# EAGLE design spindle_light (EAGLE 9.5.1)
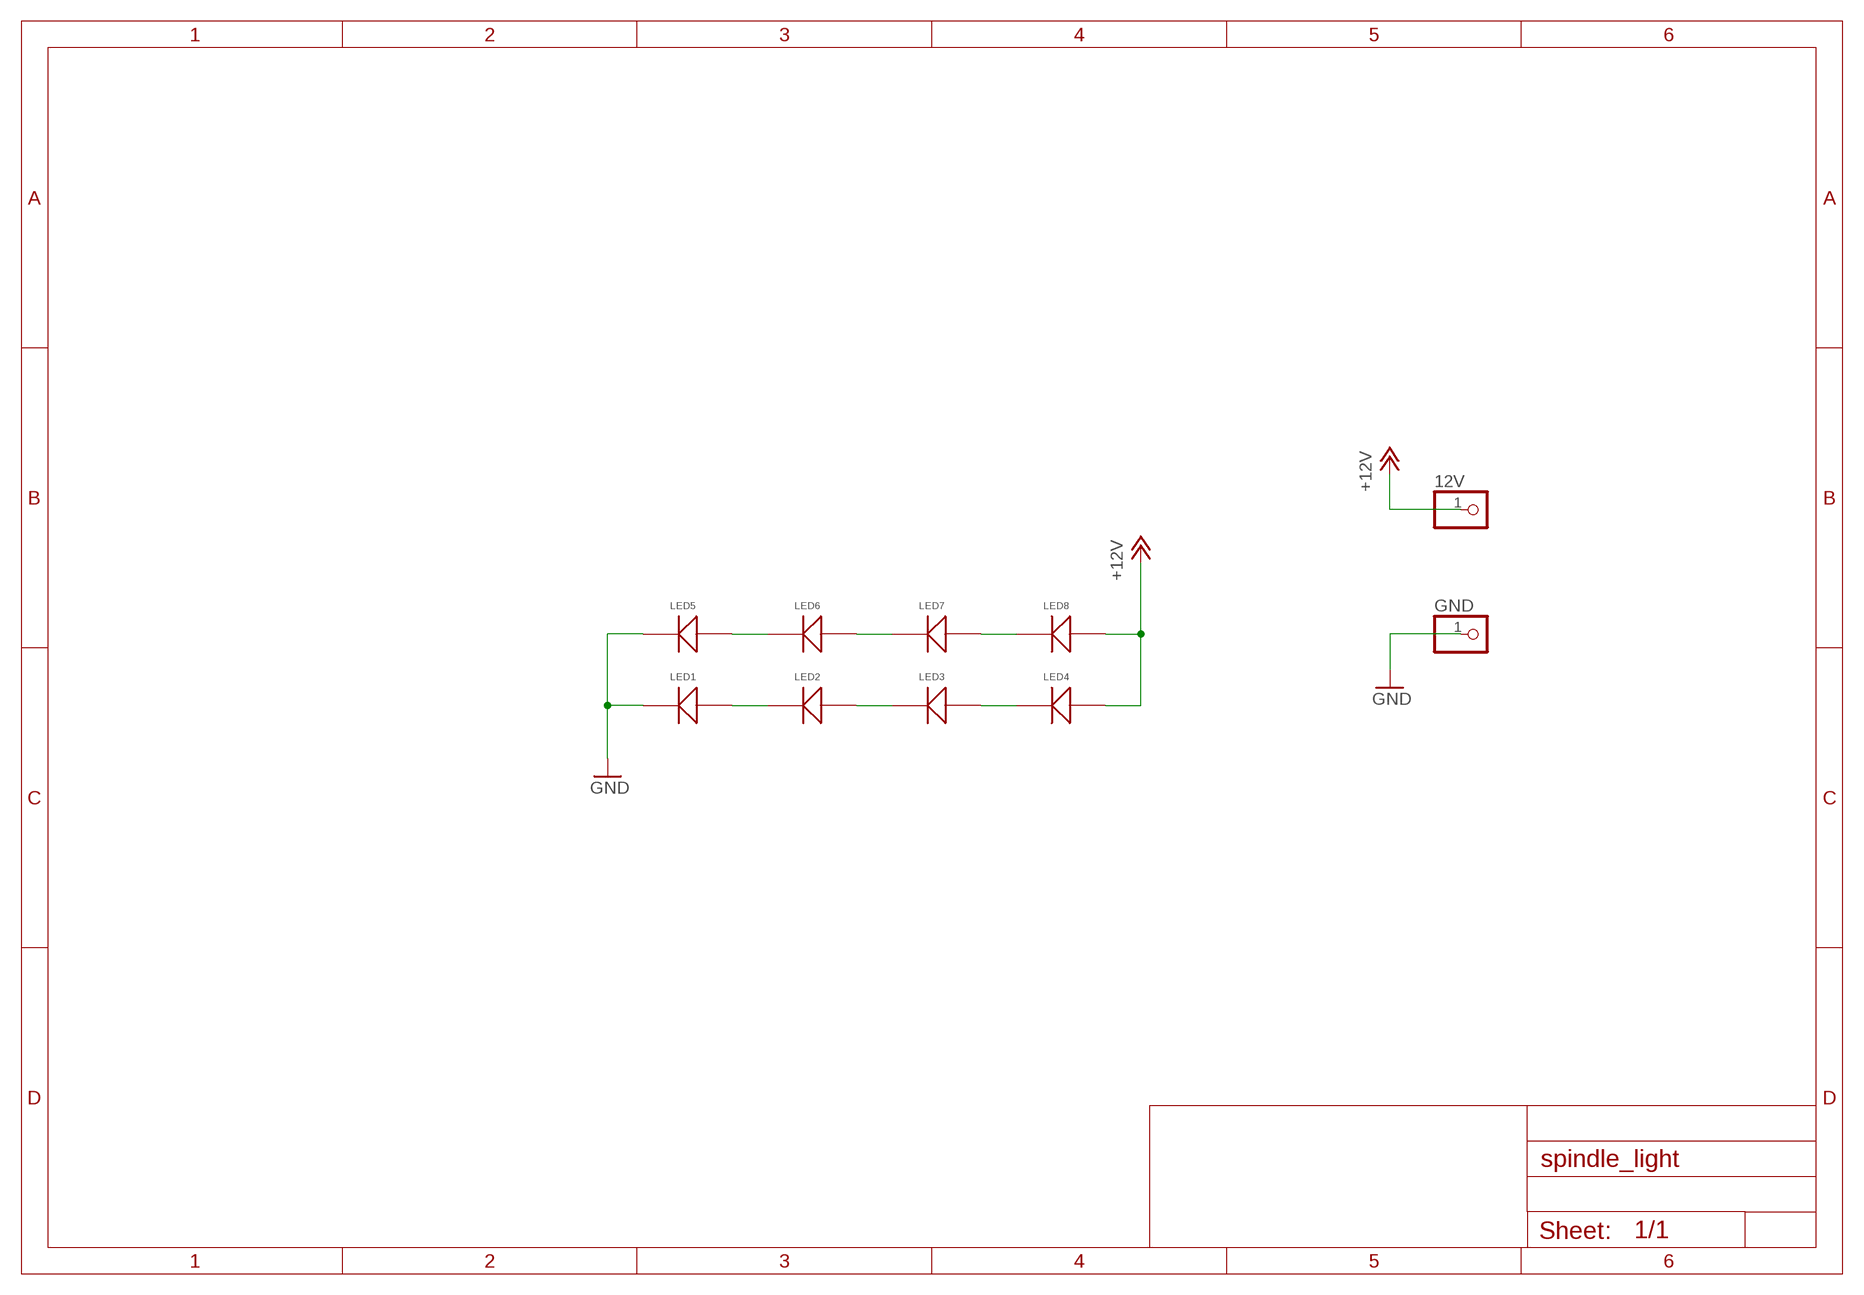
[diagram p0: schematic, sheet 1]

## Parts
12V  PINHD-1X1  [1X01]
GND  PINHD-1X1  [1X01]
LED1  RF-45HA50DS-EE-Y  [5050LED]
LED2  RF-45HA50DS-EE-Y  [5050LED]
LED3  RF-45HA50DS-EE-Y  [5050LED]
LED4  RF-45HA50DS-EE-Y  [5050LED]
LED5  RF-45HA50DS-EE-Y  [5050LED]
LED6  RF-45HA50DS-EE-Y  [5050LED]
LED7  RF-45HA50DS-EE-Y  [5050LED]
LED8  RF-45HA50DS-EE-Y  [5050LED]

## Nets
+12V: 12V.1 LED4.P$4 LED4.P$5 LED4.P$6 LED8.P$4 LED8.P$5 LED8.P$6
GND: GND.1 LED1.P$1 LED1.P$2 LED1.P$3 LED5.P$1 LED5.P$2 LED5.P$3
N$2: LED5.P$4 LED5.P$5 LED5.P$6 LED6.P$1 LED6.P$2 LED6.P$3
N$3: LED1.P$4 LED1.P$5 LED1.P$6 LED2.P$1 LED2.P$2 LED2.P$3
N$4: LED2.P$4 LED2.P$5 LED2.P$6 LED3.P$1 LED3.P$2 LED3.P$3
N$5: LED6.P$4 LED6.P$5 LED6.P$6 LED7.P$1 LED7.P$2 LED7.P$3
N$8: LED7.P$4 LED7.P$5 LED7.P$6 LED8.P$1 LED8.P$2 LED8.P$3
N$9: LED3.P$4 LED3.P$5 LED3.P$6 LED4.P$1 LED4.P$2 LED4.P$3

## Library data of the parts
12V GND = pinhead:PINHD-1X1: PIN HEADER
LED1-LED8 = NikodemBartnik:RF-45HA50DS-EE-Y: LED; SMD; 5050,PLCC6; biały neutralny; 5300÷10000mcd; 4450-5000K

## Board
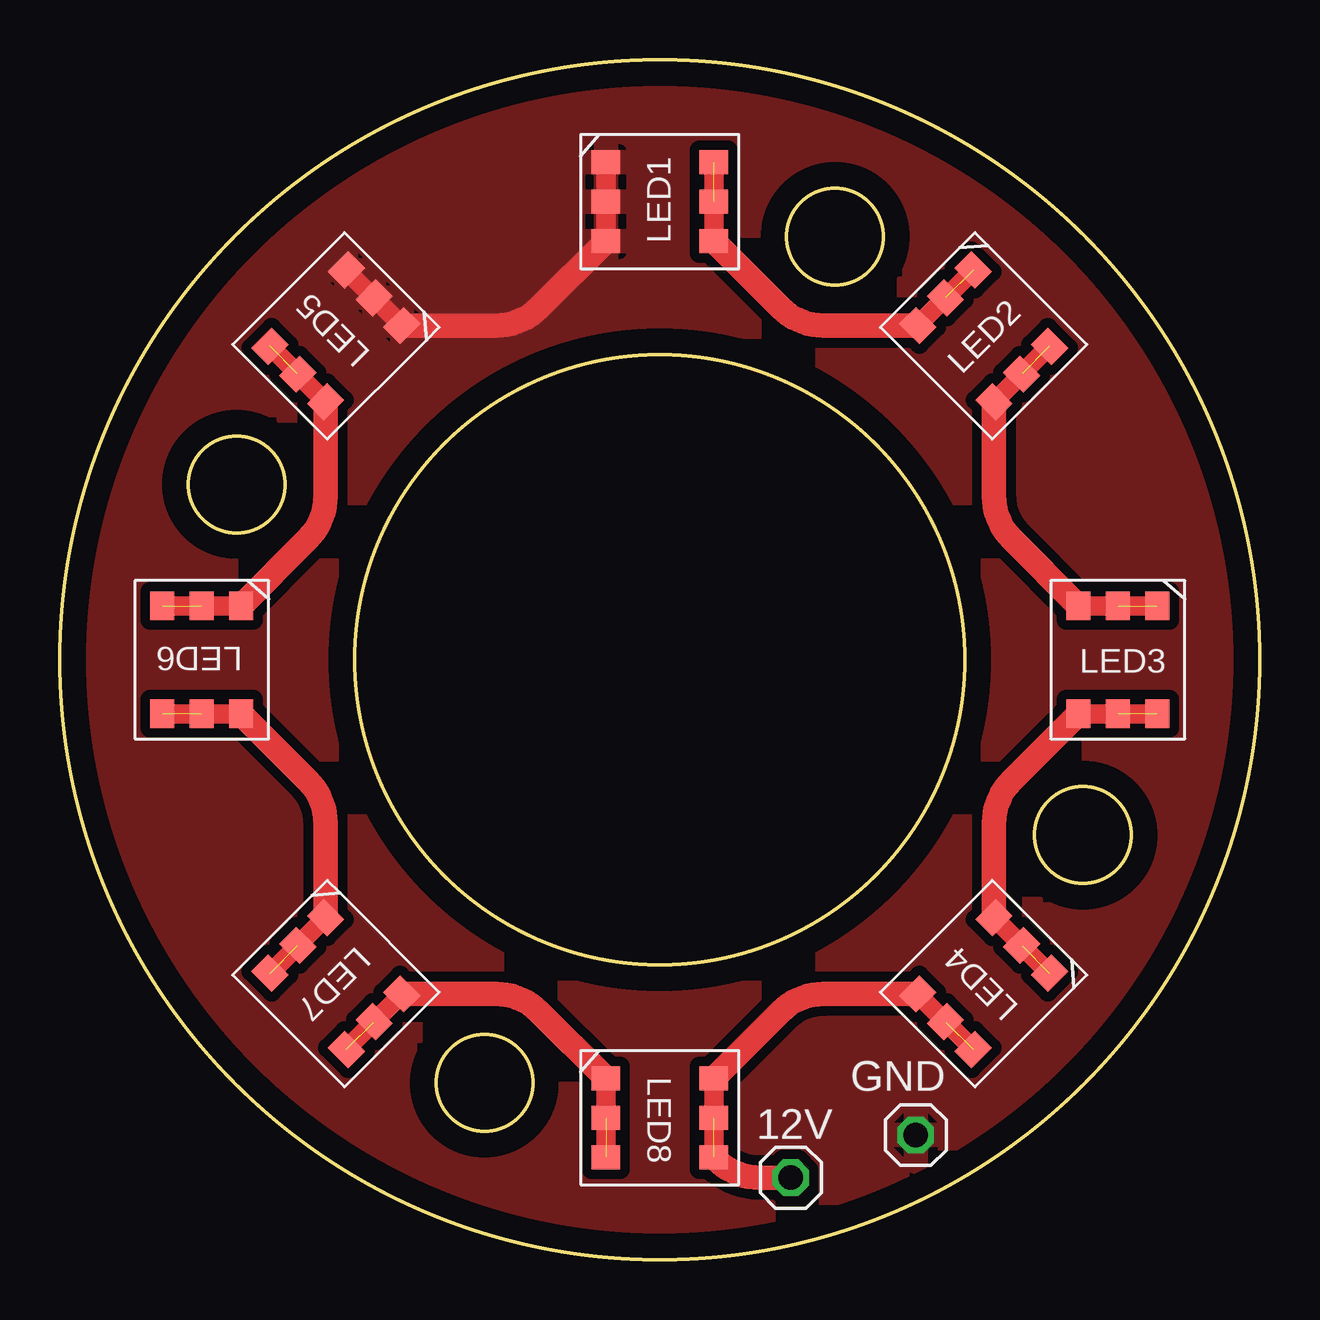
[diagram p1: board, top side]

Size 50 x 50 mm. Coordinates in mm from the lower left corner, seen from the top.
Outline: circle at 25,25 radius 25
Outline: circle at 25,25 radius 12.7
Outline: circle at 32.3,42.64 radius 2
Outline: circle at 42.64,17.7 radius 2
Outline: circle at 17.7,7.36 radius 2
Outline: circle at 7.36,32.3 radius 2
Copper layers (1*16): Top 0.035mm / dielectric 1.5mm / Bottom 0.035mm
Design rules "default": minimum track width 6mil, minimum drill 0.35mm, track to track 6mil, track to pad 6mil, pad to pad 6mil, via to via 6mil, smd to smd 6mil, copper to edge 40mil, drill to drill 6mil, minimum pad ring 10mil, minimum via ring 8mil, stop-mask expansion 4mil, vias tented up to drill 0mil, thermal gap 10mil

### Footprints (pad centres in the part's own frame; a part is rotated, then mirrored left to right if it is on the bottom)
1X01 = drill 1.016 octagon: 1 0,0
5050LED = smd 1.2 x 1: P$1 -2.25,1.64; P$2 -2.25,0; P$3 -2.25,-1.64; P$4 2.25,1.64; P$5 2.25,0; P$6 2.25,-1.64

### Placement (x,y rotation side)
12V  30.46,3.41 0 top
GND  35.67,5.19 0 top
LED1  25,44.09 0 top
LED2  38.5,38.5 315 top
LED3  44.09,25 270 top
LED4  38.5,11.5 225 top
LED5  11.5,38.5 225 top
LED6  5.91,25 270 top
LED7  11.5,11.5 315 top
LED8  25,5.91 0 top

### Tracks (layer width: path | path; a pad name or v marks a point on that pad's centre or on a via)
+12V  (2 unrouted)
  Top 0.813: LED4.P$4 LED4.P$6 | LED8.P$4 LED8.P$6
  Top 1.016: LED4.P$6 31.82,11.07 arc45 30.03,10.33 LED8.P$4 | 12V.1 29.16,3.41 arc-45 27.37,4.15 LED8.P$6
  cutout Top (isolate 0.305): 12.3,25 arc-90 25,37.7 25.13,37.7 arc-90 37.7,25.13 37.7,25 arc-90 25,12.3 arc-90
GND
  Top 0.813: LED1.P$1 LED1.P$2 LED1.P$3 | LED5.P$1 LED5.P$3
  Top 1.016: LED5.P$1 18.18,38.93 arc45 19.97,39.67 LED1.P$3
  pour Top (isolate 0.406): -0.4,25 arc90 25,-0.4 arc90 50.4,25 arc90 25,50.4 arc90
N$2  (2 unrouted)
  Top 0.813: LED5.P$4 LED5.P$6 | LED6.P$1 LED6.P$3
  Top 1.016: LED6.P$1 10.33,30.03 arc45 11.07,31.82 LED5.P$4
N$3  (2 unrouted)
  Top 0.813: LED1.P$4 LED1.P$6 | LED2.P$1 LED2.P$3
  Top 1.016: LED1.P$6 30.03,39.67 arc45 31.82,38.93 LED2.P$3
N$4  (2 unrouted)
  Top 0.813: LED2.P$4 LED2.P$6 | LED3.P$1 LED3.P$3
  Top 1.016: LED2.P$6 38.93,31.82 arc45 39.67,30.03 LED3.P$3
N$5  (2 unrouted)
  Top 0.813: LED6.P$4 LED6.P$6 | LED7.P$1 LED7.P$3
  Top 1.016: LED7.P$1 11.07,18.18 arc45 10.33,19.97 LED6.P$4
N$8  (2 unrouted)
  Top 0.813: LED7.P$4 LED7.P$6 | LED8.P$1 LED8.P$3
  Top 1.016: LED8.P$1 19.97,10.33 arc45 18.18,11.07 LED7.P$4
N$9  (2 unrouted)
  Top 0.813: LED3.P$4 LED3.P$6 | LED4.P$1 LED4.P$3
  Top 1.016: LED3.P$6 39.67,19.97 arc45 38.93,18.18 LED4.P$3